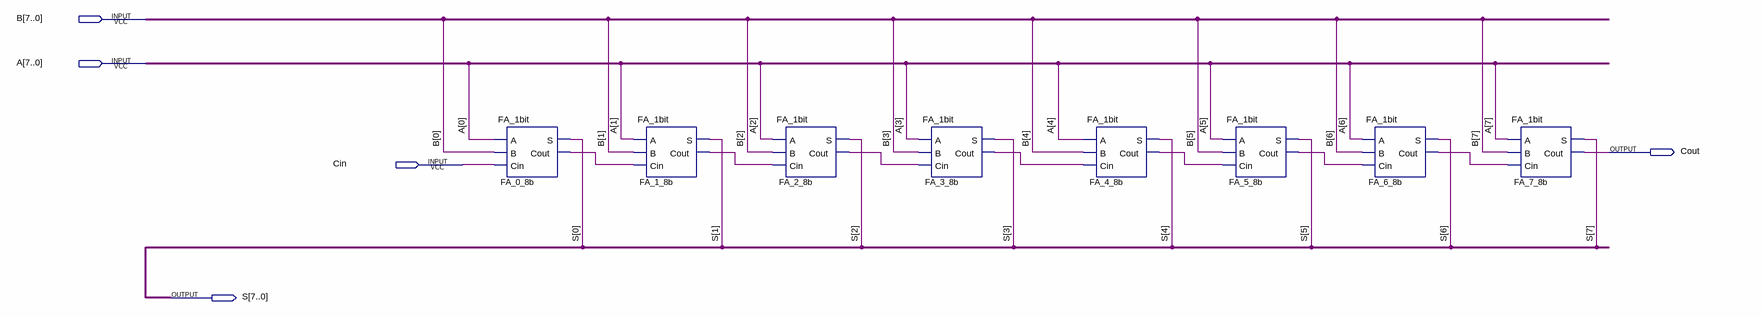
[diagram p0: schematic sheet]
// Quartus schematic FA_8bit.bdf as structural Verilog: 8 symbols, 5 pins
module FA_8bit (
  input  [7:0] B,
  input  [7:0] A,
  input  Cin,
  output Cout,
  output [7:0] S
);

  wire FA_0_8b_cout, FA_1_8b_cout, FA_2_8b_cout, FA_3_8b_cout, FA_4_8b_cout, FA_5_8b_cout, FA_6_8b_cout;

  FA_1bit FA_0_8b (.A(A[0]), .B(B[0]), .Cin(Cin), .S(S[0]), .Cout(FA_0_8b_cout));
  FA_1bit FA_1_8b (.A(A[1]), .B(B[1]), .Cin(FA_0_8b_cout), .S(S[1]), .Cout(FA_1_8b_cout));
  FA_1bit FA_2_8b (.A(A[2]), .B(B[2]), .Cin(FA_1_8b_cout), .S(S[2]), .Cout(FA_2_8b_cout));
  FA_1bit FA_3_8b (.A(A[3]), .B(B[3]), .Cin(FA_2_8b_cout), .S(S[3]), .Cout(FA_3_8b_cout));
  FA_1bit FA_4_8b (.A(A[4]), .B(B[4]), .Cin(FA_3_8b_cout), .S(S[4]), .Cout(FA_4_8b_cout));
  FA_1bit FA_5_8b (.A(A[5]), .B(B[5]), .Cin(FA_4_8b_cout), .S(S[5]), .Cout(FA_5_8b_cout));
  FA_1bit FA_6_8b (.A(A[6]), .B(B[6]), .Cin(FA_5_8b_cout), .S(S[6]), .Cout(FA_6_8b_cout));
  FA_1bit FA_7_8b (.A(A[7]), .B(B[7]), .Cin(FA_6_8b_cout), .S(S[7]), .Cout(Cout));
endmodule
